# EAGLE design otto (EAGLE 6.1)
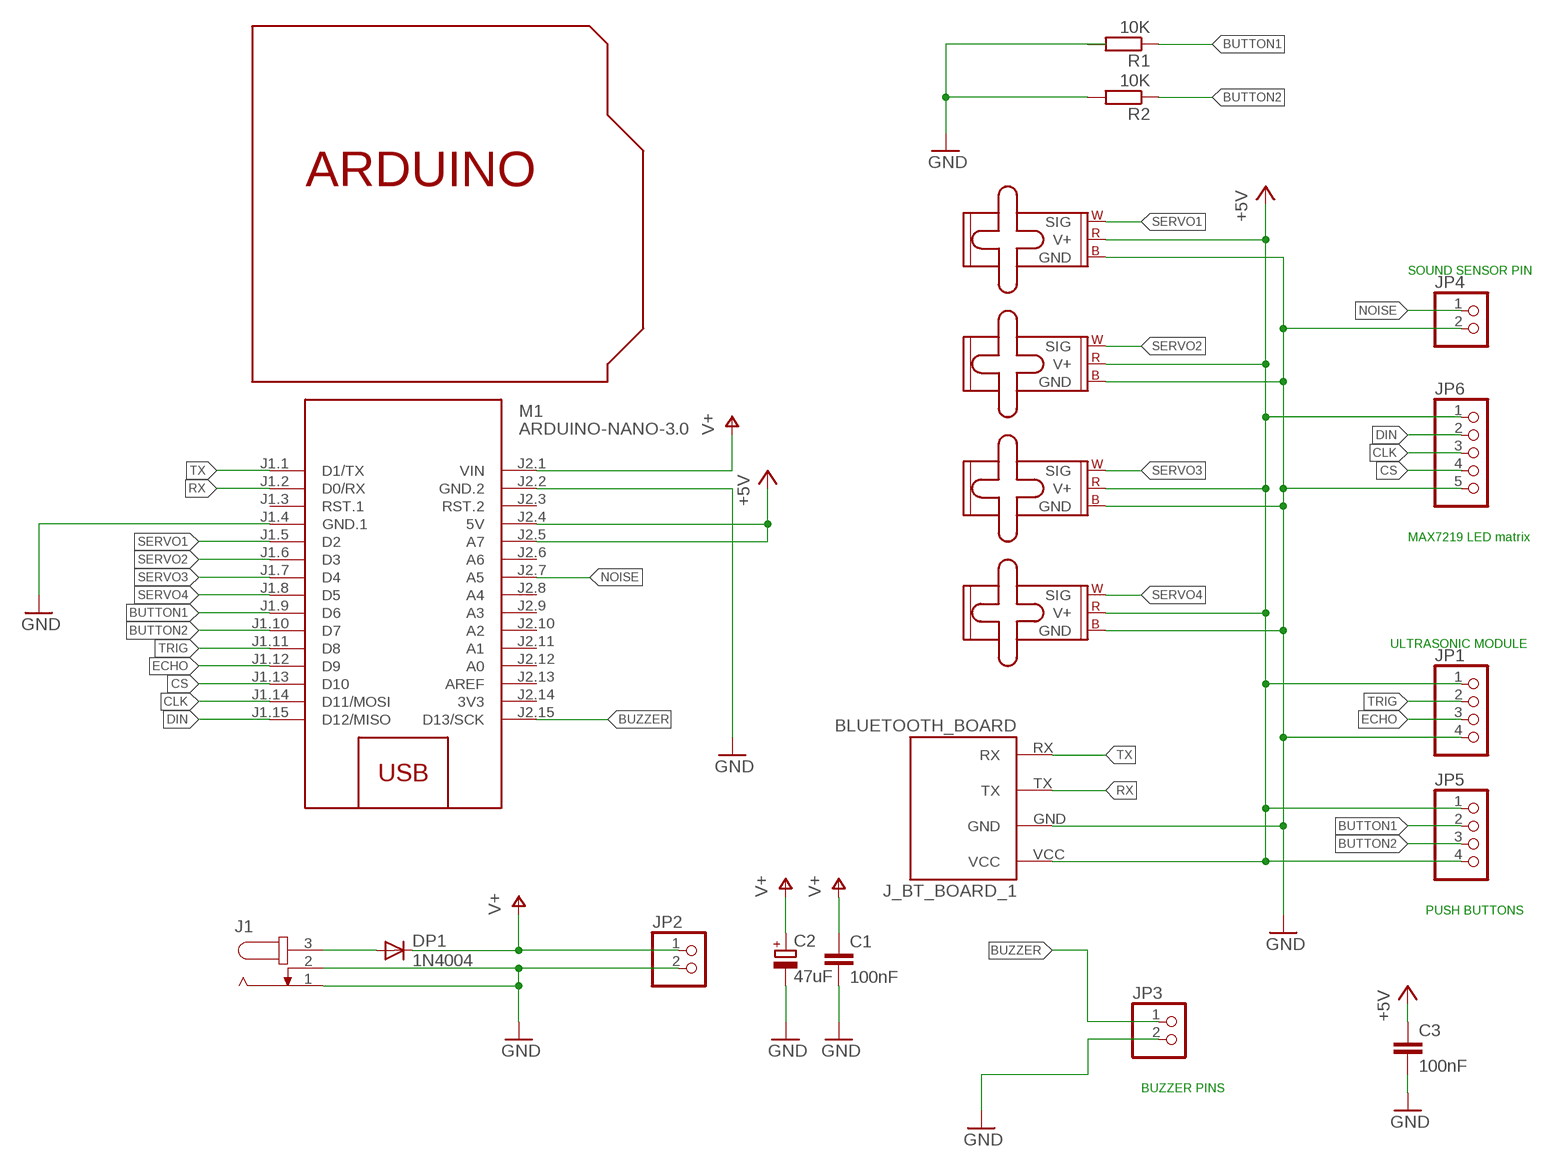
[diagram p0: schematic, sheet 1]

## Parts
C1  100nF  C-EU025-025X050  [C025-025X050]
C2  47uF  CPOL-EU140CLH-0810  [140CLH-0810]
C3  100nF  C-EU025-025X050  [C025-025X050]
DP1  1N4004  [DO41-10]
J1  JACK-PLUG0  [SPC4077]
J_BT_BOARD_1  BLUETOOTH_BOARD  [BT_BOARD_FOOTPRINT]
JP1  PINHD-1X4  [1X04]
JP2  PINHD-1X2  [1X02]
JP3  PINHD-1X2  [1X02]
JP4  PINHD-1X2  [1X02]
JP5  PINHD-1X4  [1X04]
JP6  PINHD-1X5  [1X05]
M1  ARDUINO-NANO-3.0  [ARDUINO-NANO-3.0]
M2  SMALL_SERVO  [1X03]
M3  SMALL_SERVO  [1X03]
M4  SMALL_SERVO  [1X03]
M5  SMALL_SERVO  [1X03]
R1  10K  R-EU_0207/7  [0207/7]
R2  10K  R-EU_0207/7  [0207/7]
U$1  SHIELDSMALL  [ARDUINOSHIELDSMALL]

## Nets
+5V: C3.1 J_BT_BOARD_1.VCC JP1.1 JP5.1 JP5.4 JP6.1 M1.J2.4(5V) M1.J2.5(A7) M2.2(V+) M3.2(V+) M4.2(V+) M5.2(V+)
BUTTON1: JP5.2 M1.J1.9(D6) R1.1
BUTTON2: JP5.3 M1.J1.10(D7) R2.1
BUZZER: JP3.1 M1.J2.15(D13/SCK)
CLK: JP6.3 M1.J1.14(D11/MOSI)
CS: JP6.4 M1.J1.13(D10)
DIN: JP6.2 M1.J1.15(D12/MISO)
ECHO: JP1.3 M1.J1.12(D9)
GND: C1.2 C2.- C3.2 J1.1 J1.2 J_BT_BOARD_1.GND JP1.4 JP2.2 JP3.2 JP4.2 JP6.5 M1.J1.4(GND.1) M1.J2.2(GND.2) M2.3(GND) M3.3(GND) M4.3(GND) M5.3(GND) R2.2
N$9: DP1.A J1.3
NOISE: JP4.1 M1.J2.7(A5)
RX: J_BT_BOARD_1.TX M1.J1.2(D0/RX)
SERVO1: M1.J1.5(D2) M2.1(SIG)
SERVO2: M1.J1.6(D3) M3.1(SIG)
SERVO3: M1.J1.7(D4) M4.1(SIG)
SERVO4: M1.J1.8(D5) M5.1(SIG)
TRIG: JP1.2 M1.J1.11(D8)
TX: J_BT_BOARD_1.RX M1.J1.1(D1/TX)
V+: C1.1 C2.+ DP1.C JP2.1 M1.J2.1(VIN)
Unconnected: M1.J1.3(RST.1) M1.J2.3(RST.2) M1.J2.6(A6) M1.J2.8(A4) M1.J2.9(A3) M1.J2.10(A2) M1.J2.11(A1) M1.J2.12(A0) M1.J2.13(AREF) R1.2

## Notes on the sheet
- SOUND SENSOR PIN
- MAX7219 LED matrix
- ULTRASONIC MODULE
- PUSH BUTTONS
- BUZZER PINS

## Power pins joined to a net without a drawn wire
3V3: M1.J2.14(3V3)

## Library data of the parts
C1 C3 = rcl:C-EU: CAPACITOR, European symbol
C2 = rcl:CPOL-EU: POLARIZED CAPACITOR, European symbol
DP1 = adafruit:1N4004: DIODE General purpose 1N400x type rectifier (With bigger pads) http://www.ladyada.net/library/pcb/eaglelibrary.html
J1 = con-jack:JACK-PLUG: DC POWER JACK Power Jack, DC, Right Angle, Through Hole, Rated 5A at 16VDC, PC Terminals Distributor: Farnell (www.Farnell.de) Drawing: 84N1161.pdf / 84N1162.pdf Manufacturer: SPC Technology (www.spctechnology.com) Type: SPC4077 / SPC 4078; OC_FARNELL: unknown; OC_NEWARK: unknown
J_BT_BOARD_1 = Bluetooth HC-05:BLUETOOTH_BOARD: Bluetooth Board V1.05
JP1 JP5 = pinhead:PINHD-1X4: PIN HEADER
JP2-JP4 = pinhead:PINHD-1X2: PIN HEADER
JP6 = pinhead:PINHD-1X5: PIN HEADER
M1 = diy-modules:ARDUINO-NANO-3.0: Arduino Nano 3.0
M2-M5 = SparkFun-Electromechanical:SMALL_SERVO: Small servo motor This is the small servo used in the SIK. SKU: ROB-09065
R1 R2 = rcl:R-EU_: RESISTOR, European symbol
U$1 = adafruit:SHIELDSMALL

## Board
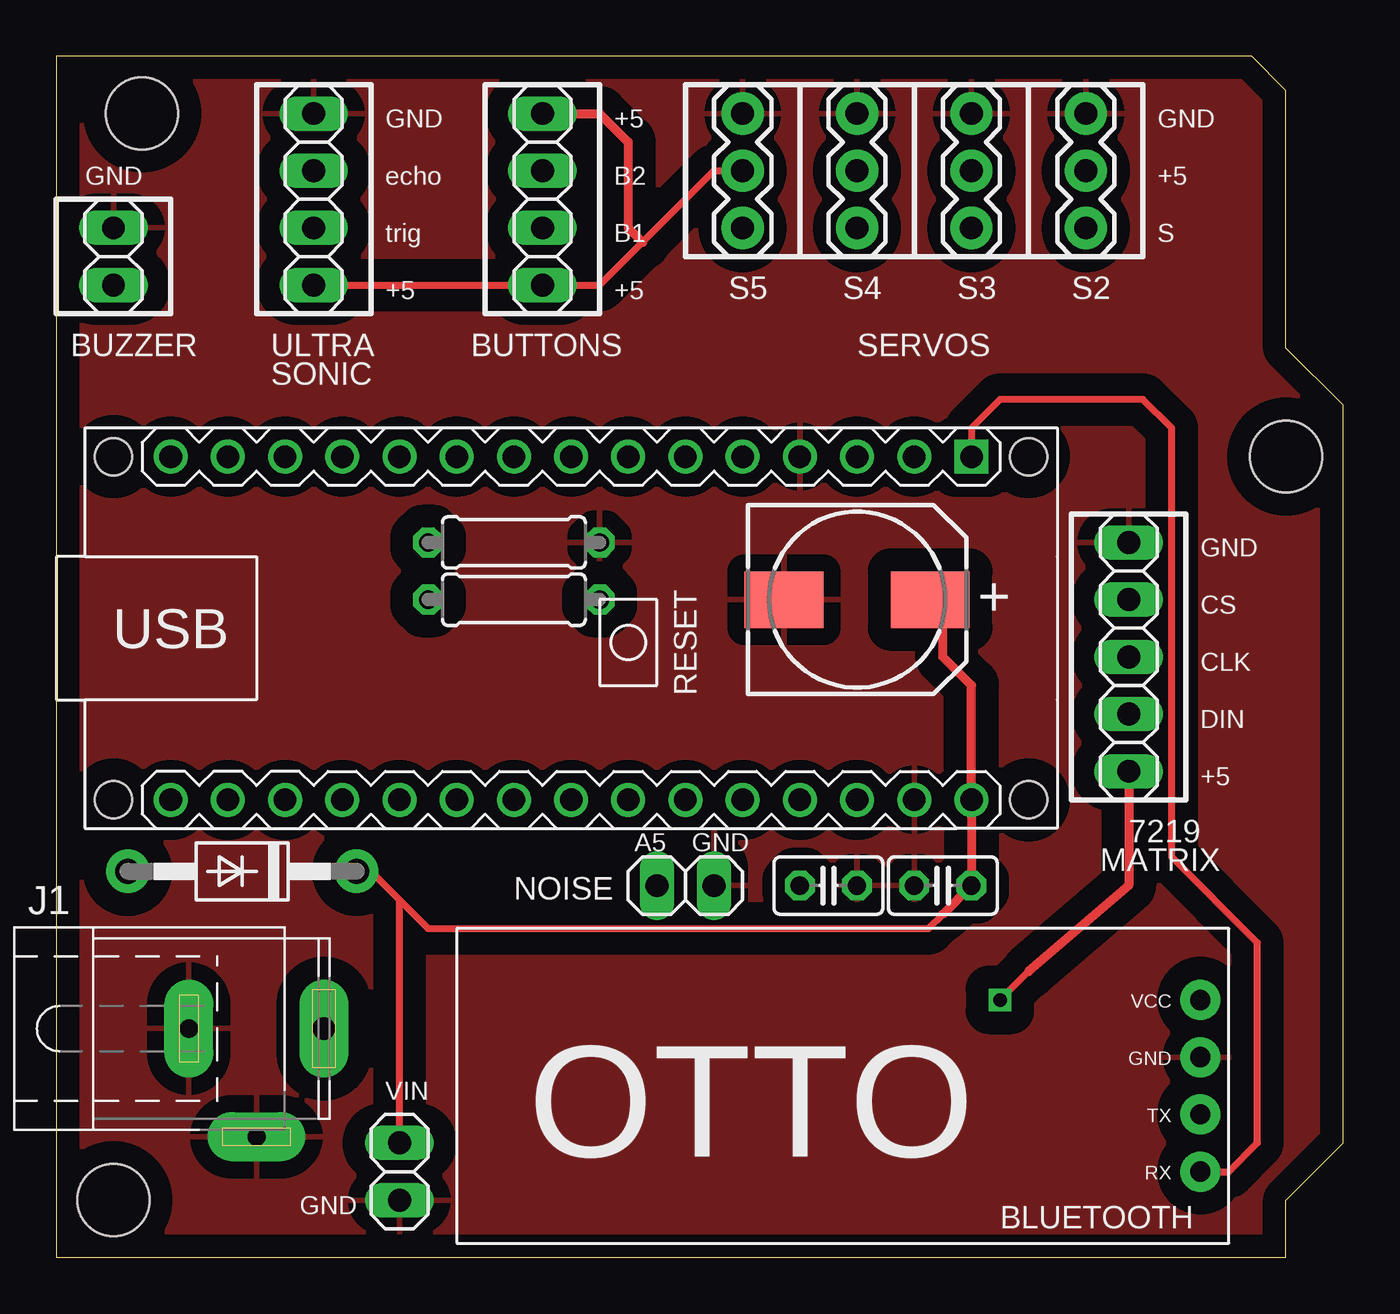
[diagram p1: board, top side]
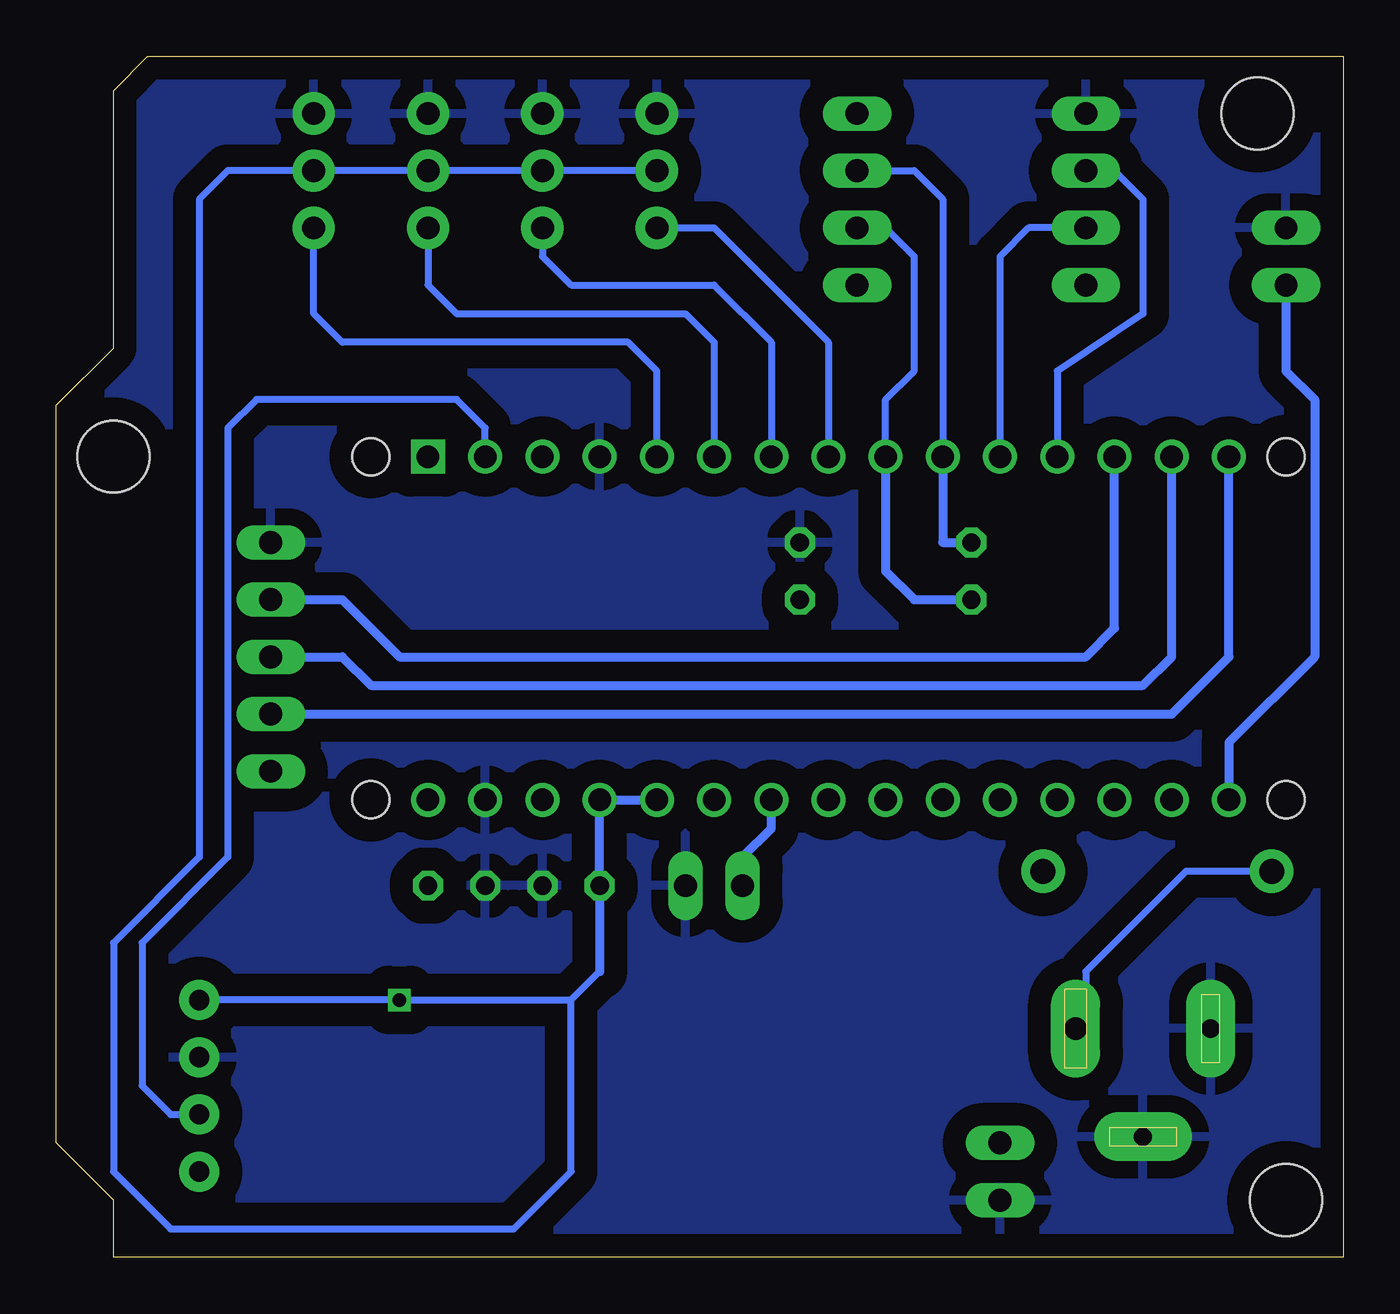
[diagram p2: board, bottom side, seen from below]

Size 57.15 x 53.34 mm. Coordinates in mm from the lower left corner, seen from the top.
Copper layers (1*16): Top 0.035mm / dielectric 1.5mm / Bottom 0.035mm
Design rules: minimum track width 10mil, minimum drill 24mil, track to track 8mil, track to pad 8mil, pad to pad 8mil, via to via 8mil, smd to smd 8mil, copper to edge 40mil, drill to drill 8mil, minimum pad ring 10mil, minimum via ring 8mil, stop-mask expansion 4mil, vias tented up to drill 0mil, thermal gap 30mil

### Footprints (pad centres in the part's own frame; a part is rotated, then mirrored left to right if it is on the bottom)
C025-025X050 = drill 0.813 octagon: 1 -1.27,0; 2 1.27,0
140CLH-0810 = smd 3.5 x 2.5: + 3.25,0; - -3.25,0
DO41-10 = drill 1.118 pad 1.93: A 5.08,0; C -5.08,0
SPC4077 = drill 0.8 pad 2.184 long: 1 -3,0; 2 0,-4.8 | drill 1 pad 2.184 long: 3 3,0
BT_BOARD_FOOTPRINT = drill 0.9 pad 1.778: GND -16.51,-1.27; RX -16.51,3.81; TX -16.51,1.27; VCC -16.51,-3.81
1X04 = drill 1.016 long: 1 -3.81,0; 2 -1.27,0; 3 1.27,0; 4 3.81,0
1X02 = drill 1.016 long: 1 -1.27,0; 2 1.27,0
1X05 = drill 1.016 long: 1 -5.08,0; 2 -2.54,0; 3 0,0; 4 2.54,0; 5 5.08,0
ARDUINO-NANO-3.0 = drill 1 square: J1.1 17.78,7.62 | drill 1: J1.2 15.24,7.62; J1.3 12.7,7.62; J1.4 10.16,7.62; J1.5 7.62,7.62; J1.6 5.08,7.62; J1.7 2.54,7.62; J1.8 0,7.62; J1.9 -2.54,7.62; J1.10 -5.08,7.62; J1.11 -7.62,7.62; J1.12 -10.16,7.62; J1.13 -12.7,7.62; J1.14 -15.24,7.62; J1.15 -17.78,7.62; J2.1 17.78,-7.62; J2.2 15.24,-7.62; J2.3 12.7,-7.62; J2.4 10.16,-7.62; J2.5 7.62,-7.62; J2.6 5.08,-7.62; J2.7 2.54,-7.62; J2.8 0,-7.62; J2.9 -2.54,-7.62; J2.10 -5.08,-7.62; J2.11 -7.62,-7.62; J2.12 -10.16,-7.62; J2.13 -12.7,-7.62; J2.14 -15.24,-7.62; J2.15 -17.78,-7.62 | hole 1.651: -20.32,7.62; -20.32,-7.62; 20.32,-7.62; 20.32,7.62
1X03 = drill 1.016 pad 1.88: 1 0,0; 2 2.54,0; 3 5.08,0
0207/7 = drill 0.813 octagon: 1 -3.81,0; 2 3.81,0
ARDUINOSHIELDSMALL = hole 3.2: -13.97,33.02; 36.83,17.78; -15.24,-15.24

### Placement (x,y rotation side)
C1  39.37,16.51 180 top
C2  35.56,29.21 0 top
C3  34.29,16.51 0 top
DP1  8.25,17.14 180 top
J1  8.89,10.16 0 top
J_BT_BOARD_1  34.29,7.62 180 top
JP1  11.43,46.99 90 top
JP2  15.24,3.81 270 top
JP3  2.54,44.45 90 top
JP4  27.94,16.51 0 top
JP5  21.59,46.99 90 top
JP6  47.62,26.67 90 top
M1  22.86,27.94 0 top
M2  45.72,45.72 90 top
M3  40.64,45.72 90 top
M4  35.56,45.72 90 top
M5  30.48,45.72 90 top
R1  20.32,29.21 0 top
R2  20.32,31.75 0 top
U$1  17.78,17.78 0 top

### Tracks (layer width: path | path; a pad name or v marks a point on that pad's centre or on a via)
+5V  (via drill 0.6)
  Top 0.305: JP1.1 JP5.1 24.13,43.18 26.04,45.09 29.21,48.26 M5.2 | 43.18,12.7 v41.91,11.43
  Top 0.406: JP6.1 47.62,16.51 43.18,12.7 | JP5.4 24.13,50.8 25.4,49.53 25.4,45.72 26.04,45.09
  Bottom 0.305: M5.2 M4.2 M3.2 M2.2 49.53,48.26 50.8,46.99 50.8,17.78 54.61,13.97 54.61,3.81 52.07,1.27 36.83,1.27 34.29,3.81 34.29,11.43 | 34.29,11.43 v41.91,11.43 J_BT_BOARD_1.VCC | 34.29,11.43 33.02,12.7
  Bottom 0.406: 33.02,12.7 C3.1 M1.J2.4 M1.J2.5
BUTTON1
  Bottom 0.305: JP5.2 20.32,45.72 19.05,44.45 19.05,39.37 20.32,38.1 M1.J1.9
  Bottom 0.406: M1.J1.9 20.32,30.48 19.05,29.21 R1.1
BUTTON2
  Bottom 0.305: JP5.3 19.05,48.26 17.78,46.99 M1.J1.10
  Bottom 0.406: M1.J1.10 17.78,31.75 R2.1
BUZZER
  Bottom 0.406: JP3.1 2.54,39.37 1.27,38.1 1.27,26.67 5.08,22.86 M1.J2.15
CLK
  Bottom 0.406: M1.J1.14 7.62,26.67 8.89,25.4 43.18,25.4 44.45,26.67 JP6.3
CS
  Bottom 0.406: JP6.4 44.45,29.21 41.91,26.67 11.43,26.67 10.16,27.94 M1.J1.13
DIN
  Bottom 0.406: JP6.2 7.62,24.13 5.08,26.67 M1.J1.15
ECHO
  Bottom 0.305: JP1.3 10.16,48.26 8.89,46.99 8.89,41.91 12.7,39.37 M1.J1.12
GND
  pour Bottom (isolate 1.016): 0,53.34 53.34,53.34 54.61,52.07 54.61,40.64 57.15,38.1 57.15,5.08 54.61,2.54 54.61,0 0,0
  pour Top (isolate 1.016): 0,53.34 53.34,53.34 54.61,52.07 54.61,40.64 57.15,38.1 57.15,5.08 54.61,2.54 54.61,0 0,0
N$9
  Bottom 0.305: DP1.A 6.98,17.14 11.43,12.7 11.43,10.62 J1.3
NOISE
  Bottom 0.406: JP4.1 26.67,17.78 25.4,19.05 M1.J2.7
RX
  Bottom 0.305: M1.J1.2 38.1,36.83 39.37,38.1 48.26,38.1 49.53,36.83 49.53,17.78 53.34,13.97 53.34,7.62 52.07,6.35 J_BT_BOARD_1.TX
SERVO1
  Bottom 0.305: M1.J1.5 30.48,39.37 31.75,40.64 44.45,40.64 45.72,41.91 M2.1
SERVO2
  Bottom 0.305: M3.1 40.64,43.18 39.37,41.91 29.21,41.91 27.94,40.64 M1.J1.6
SERVO3
  Bottom 0.305: M4.1 35.56,44.45 34.29,43.18 27.94,43.18 25.4,40.64 M1.J1.7
SERVO4
  Bottom 0.305: M5.1 27.94,45.72 22.86,40.64 M1.J1.8
TRIG
  Bottom 0.305: JP1.2 13.97,45.72 15.24,44.45 M1.J1.11
TX
  Top 0.305: J_BT_BOARD_1.RX 52.07,3.81 53.34,5.08 53.34,13.97 49.53,17.78 49.53,36.83 48.26,38.1 41.91,38.1 40.64,36.83 M1.J1.1
V+
  Top 0.305: DP1.C 13.97,17.14 15.24,15.88 | 15.24,15.88 16.51,14.61 38.73,14.61 39.37,15.24 | JP2.1 15.24,15.88
  Top 0.406: 39.37,15.24 C1.1 M1.J2.1 40.64,25.4 39.37,26.67 39.37,27.94 39.37,28.65 | 39.37,29.21 39.37,28.65 | 39.37,28.65 C2.+

### Text on the board
tNames: GND | +5 | GND | GND | echo | B2 | +5 | trig | B1 | S | +5 | +5 | S5 | S4 | S3 | S2 | BUZZER | ULTRA | BUTTONS | SERVOS | SONIC | GND | CS | + | CLK | DIN | +5 | A5 | GND | 7219 | MATRIX | NOISE | VIN | OTTO | GND | BLUETOOTH